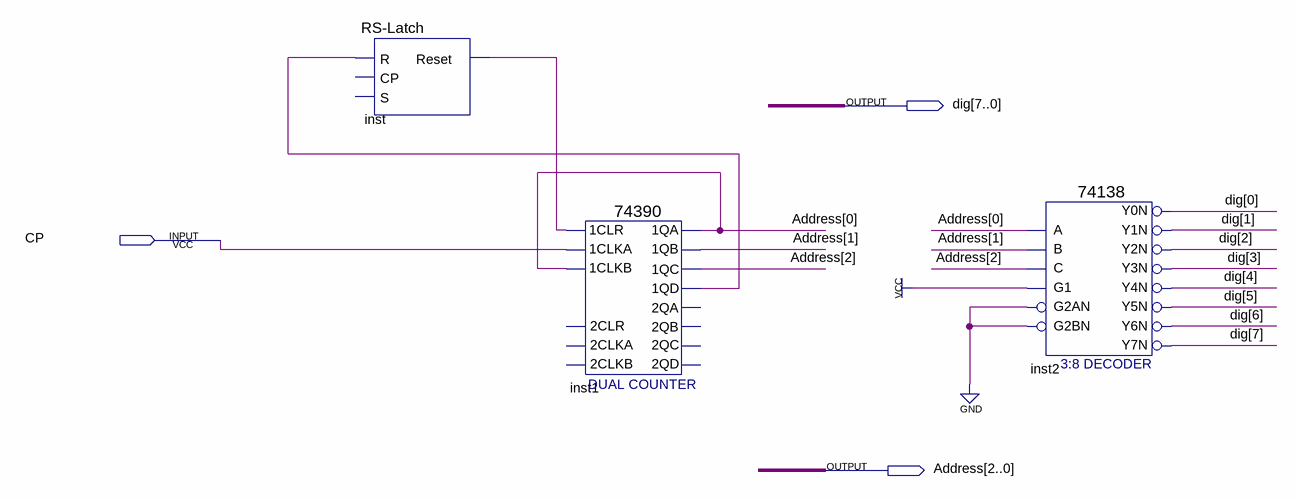
[diagram p0: schematic sheet]
// Quartus schematic Bit-Selective Signal Generator.bdf as structural Verilog: 3 symbols, 3 pins
module \Bit-Selective_Signal_Generator  (
  input  CP,
  output [7:0] dig,
  output [2:0] Address
);

  wire inst1_1qd, inst_reset;

  \RS-Latch  inst (.R(inst1_1qd), .Reset(inst_reset));  // open: CP, S
  \74390  inst1 (
    .\1CLR (inst_reset), .\1CLKA (CP), .\1CLKB (Address[0]), .\1QA (Address[0]), .\1QB (Address[1]),
    .\1QC (Address[2]), .\1QD (inst1_1qd));  // open: 2CLKA, 2CLR, 2CLKB, 2QA, 2QB, 2QC, 2QD
  \74138  inst2 (
    .A(Address[0]), .B(Address[1]), .G1(1'b1), .C(Address[2]), .G2AN(1'b0), .G2BN(1'b0), .Y0N(dig[0]),
    .Y1N(dig[1]), .Y2N(dig[2]), .Y3N(dig[3]), .Y4N(dig[4]), .Y5N(dig[5]), .Y6N(dig[6]), .Y7N(dig[7]));
endmodule
